# EAGLE design MS5803-01BA (EAGLE 9.6.2)
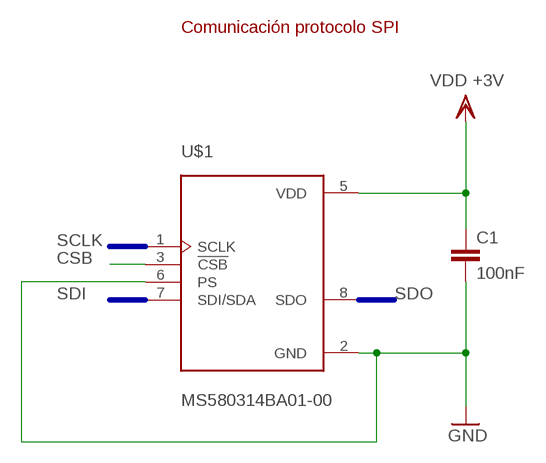
[diagram p0: schematic, sheet 1]

## Parts
C1  100nF  1.0NF/1000PF-1206-2KV-10%  [1206]
U$1  MS580314BA01-00  [XDCR_MS580314BA01-00]

## Nets
CSB: U$1.3(!CSB)
GND: C1.2 U$1.2(GND) U$1.6(PS)
VDD: C1.1 U$1.5(VDD) ; supply symbol labelled VDD +3V
Unconnected: U$1.1(SCLK) U$1.7(SDI/SDA) U$1.8(SDO)

## Buses
SCLK
SDI
SDO

## Notes on the sheet
- Comunicación protocolo SPI

## Library data of the parts
C1 = SparkFun-Capacitors:1.0NF/1000PF: 1nF/1,000pF ceramic capacitors A capacitor is a passive two-terminal electrical component used to store electrical energy temporarily in an electric field.; PROD_ID: CAP-16238; VALUE: 1nF
U$1 = MS580314BA01-00:MS580314BA01-00: MINIATURE ALTIMETER MODULE Check availability <https://pricing.snapeda.com/parts/MS580314BA01-00/Measurement%20Specialties/view-part?ref=eda>; AVAILABILITY: In Stock; CHECK_PRICES: https://www.snapeda.com/parts/MS580314BA01-00/Measurement+Specialites/view-part/?ref=eda; DESCRIPTION: Pressure Sensor 203.05PSI (1400kPa) Absolute 24 b 8-SMD Module; MF: Measurement Specialties; MP: MS580314BA01-00; PACKAGE: None; PRICE: None; SNAPEDA_LINK: https://www.snapeda.com/parts/MS580314BA01-00/Measurement+Specialites/view-part/?ref=snap

## Board
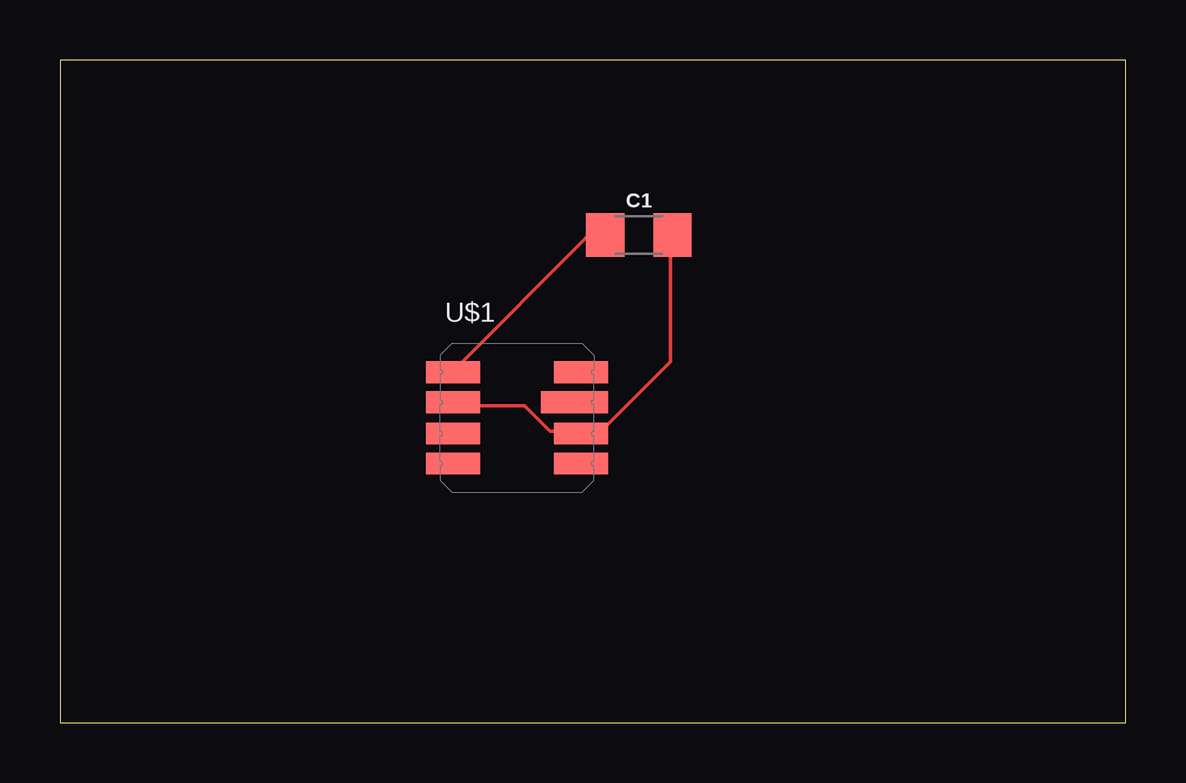
[diagram p1: board, top side]

Size 44.43 x 27.61 mm. Coordinates in mm from the lower left corner, seen from the top.
Outline: 0,0 44.43,0 44.43,27.61 0,27.61 0,0
Copper layers (1*16): Top 0.035mm / dielectric 1.5mm / Bottom 0.035mm
Design rules "default": minimum track width 6mil, minimum drill 0.35mm, track to track 6mil, track to pad 6mil, pad to pad 6mil, via to via 6mil, smd to smd 6mil, copper to edge 40mil, drill to drill 6mil, minimum pad ring 10mil, minimum via ring 8mil, stop-mask expansion 4mil, vias tented up to drill 0mil, thermal gap 10mil

### Footprints (pad centres in the part's own frame; a part is rotated, then mirrored left to right if it is on the bottom)
1206 = smd 1.6 x 1.8: 1 -1.4,0; 2 1.4,0
XDCR_MS580314BA01-00 = smd 2.25 x 0.9: 1 2.675,-1.899; 2 2.675,-0.649; 4 2.675,1.901; 5 -2.675,1.901; 6 -2.675,0.651; 7 -2.675,-0.649; 8 -2.675,-1.899 | smd 2.8 x 0.9: 3 2.4,0.651

### Placement (x,y rotation side)
C1  24.13,20.32 0 top
U$1  19.05,12.7 0 top

### Tracks (layer width: path | path; a pad name or v marks a point on that pad's centre or on a via)
GND
  Top 0.152: C1.2 25.45,20.22 25.45,15.04 22.55,12.14 21.79,12.14 U$1.2 21.64,12.14 20.42,12.14 19.36,13.21 16.46,13.21 U$1.6
VDD
  Top 0.152: C1.1 22.71,20.22 21.95,20.22 16.46,14.73 U$1.5